# Altium schematic sheet Sheet1.SchDoc
size A2; SheetNumber: 1; SheetTotal: 1
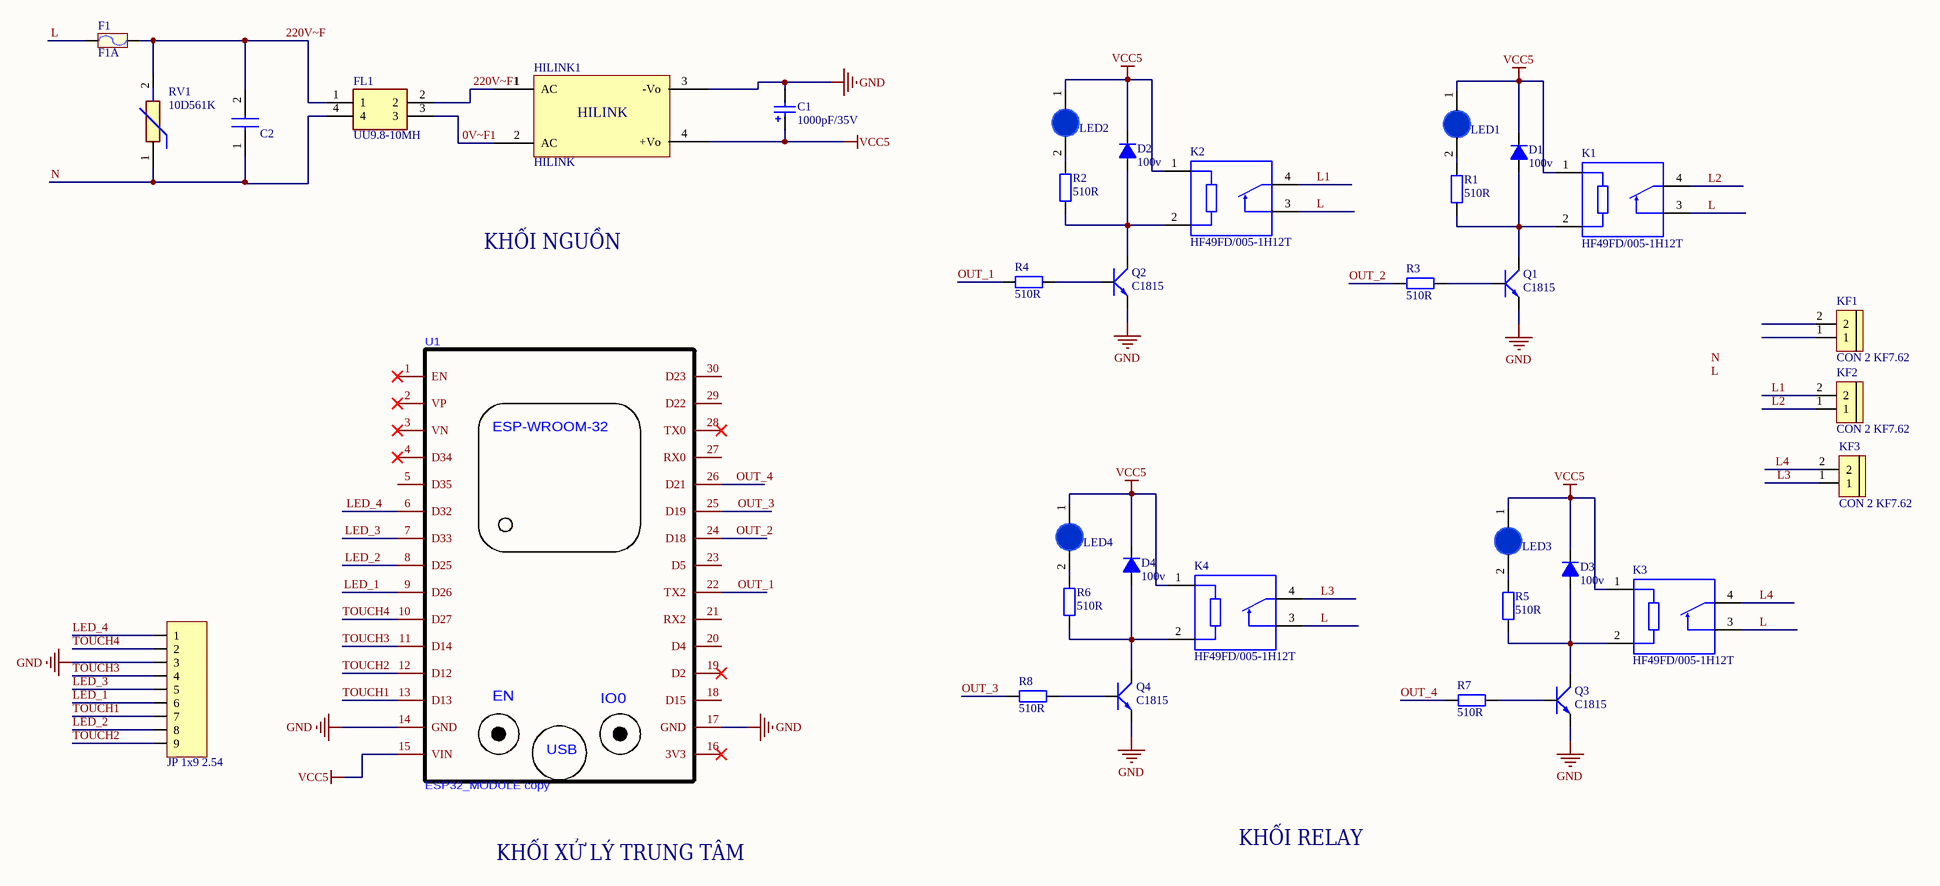
[diagram p0: Sheet1.SchDoc]

## Parts
C1  value 1000pF/35V  [CP2/5]  (hidden comment: Cap Pol3)
C2  R46KF3100JMP0K  [R46KF3100JMP0K]  (value not drawn)
D1  100v  [DIODE 0.5A]
D2  100v  [DIODE 0.5A]
D3  100v  [DIODE 0.5A]
D4  100v  [DIODE 0.5A]
F1  F1A  [Fuse]
FL1  UU9.8-10MH  [UU9810MH]
HILINK1  HILINK  [HILINK_1W]
JP1  JP 1x9 2.54  [JP 1x9 CT]
K1  HF49FD/005-1H12T  [RELAY_HF49FD/005-1H12T]
K2  HF49FD/005-1H12T  [RELAY_HF49FD/005-1H12T]
K3  HF49FD/005-1H12T  [RELAY_HF49FD/005-1H12T]
K4  HF49FD/005-1H12T  [RELAY_HF49FD/005-1H12T]
KF1  CON 2 KF7.62  [CON 2 KF7.62]
KF2  CON 2 KF7.62  [CON 2 KF7.62]
KF3  CON 2 KF7.62  [CON 2 KF7.62]
LED1  LED 3mm  [LED-3MM-BLUE]  (value not drawn)
LED2  LED 3mm  [LED-3MM-BLUE]  (value not drawn)
LED3  LED 3mm  [LED-3MM-BLUE]  (value not drawn)
LED4  LED 3mm  [LED-3MM-BLUE]  (value not drawn)
Q1  C1815  [C1815_cam]
Q2  C1815  [C1815_cam]
Q3  C1815  [C1815_cam]
Q4  C1815  [C1815_cam]
R1  510R  [R1/4W]
R2  510R  [R1/4W]
R3  510R  [R1/4W]
R4  510R  [R1/4W]
R5  510R  [R1/4W]
R6  510R  [R1/4W]
R7  510R  [R1/4W]
R8  510R  [R1/4W]
RV1  10D561K  [10D561K]
U1  ESP32_MODULE copy  [ESP32-WIFIMODULE-FOOTPRINT]

## Nets
GND: C1.2 HILINK1.3(-Vo) JP1.3 Q1.1(E) Q2.1(E) Q3.1(E) Q4.1(E) U1.14(GND) U1.17(GND)
VCC5: C1.1 D1.2(K) D2.2(K) D3.2(K) D4.2(K) HILINK1.4(+Vo) K1.1(L1) K2.1(L1) K3.1(L1) K4.1(L1) LED1.1(A) LED2.1(A) LED3.1(A) LED4.1(A) U1.15(VIN)
0V~F1: FL1.3 HILINK1.2(AC)
220V~F: C2.2 F1.2 FL1.1 RV1.2
220V~F1: FL1.2 HILINK1.1(AC)
L: F1.1 K1.3(C2) K2.3(C2) K3.3(C2) K4.3(C2)
L1: K2.4(C1) KF2.2
L2: K1.4(C1) KF2.1
L3: K4.4(C1) KF3.1
L4: K3.4(C1) KF3.2
LED_1: JP1.6 U1.9(D26)
LED_2: JP1.8 U1.8(D25)
LED_3: JP1.5 U1.7(D33)
LED_4: JP1.1 U1.6(D32)
N: C2.1 FL1.4 RV1.1
OUT_1: R4.1 U1.22(TX2)
OUT_2: R3.1 U1.24(D18)
OUT_3: R8.1 U1.25(D19)
OUT_4: R7.1 U1.26(D21)
TOUCH1: JP1.7 U1.13(D13)
TOUCH2: JP1.9 U1.12(D12)
TOUCH3: JP1.4 U1.11(D14)
TOUCH4: JP1.2 U1.10(D27)
NetD1_1: D1.1(A) K1.2(L2) Q1.2(C) R1.2
NetD2_1: D2.1(A) K2.2(L2) Q2.2(C) R2.2
NetD3_1: D3.1(A) K3.2(L2) Q3.2(C) R5.2
NetD4_1: D4.1(A) K4.2(L2) Q4.2(C) R6.2
NetLED1_2: LED1.2(K) R1.1
NetLED2_2: LED2.2(K) R2.1
NetLED3_2: LED3.2(K) R5.1
NetLED4_2: LED4.2(K) R6.1
NetQ1_3: Q1.3(B) R3.2
NetQ2_3: Q2.3(B) R4.2
NetQ3_3: Q3.3(B) R7.2
NetQ4_3: Q4.3(B) R8.2

Not connected (* = marked no-connect by the designer): KF1 1 2; U1 1(EN)* 2(VP)* 3(VN)* 4(D34)* 5(D35) 16(3V3)* 18(D15) 19(D2)* 20(D4) 21(RX2) 23(D5) 27(RX0) 28(TX0)* 29(D22) 30(D23)

## Notes on the sheet
- KHỐI NGUỒN
- KHỐI XỬ LÝ TRUNG TÂM
- KHỐI RELAY
- Labels drawn without touching a wire or pin: L, N
- (in symbol ESP32_MODULE copy) ESP-WROOM-32; IO0; USB

## Library data of the parts
C1 = Cap Pol3: Polarized Capacitor (Surface Mount); VALUE: C?; LatestRevisionDate: 17-Jul-2002; LatestRevisionNote: Re-released for DXP Platform.; PackageReference: C0805; Publisher: Altium Limited
C2 = R46KF3100JMP0K: Capacitor; Manufacturer_Name: Kemet; Datasheet Link: https://api.kemet.com/component-edge/download/specsheet/R46KF3100JMP0K.pdf; Height: 12.1mm; Manufacturer_Part_Number: R46KF3100JMP0K; Mouser Part Number: 80-R46KF3100JMP0K; Mouser Price/Stock: https://www.mouser.co.uk/ProductDetail/KEMET/R46KF3100JMP0K/?qs=gt1LBUVyoHk5JqGpZKIGRw%3D%3D
D1-D4 = Diode 1N4148: Cắm; Ten_Linh_Kien: Diode 1N4148 DO35 450mA 100V ( 1N4148 DIP); Don_Vi: Con; Ma_Hang: MH001065; Ghi Chu: *; Kieu_Chan: *; Chung_Loai: Cắm
F1 = Fuse: Designed by: VanDungEvn; Value: Fuse
FL1 = UU9.8-10MH: Filter; Manufacturer_Name: Guangdong Fenghua Advanced Tech; Datasheet Link: https://datasheet.lcsc.com/szlcsc/1811111206_Guangdong-Fenghua-Advanced-Tech-UU9-8-10mH_C148474.pdf; Height: 17mm; Manufacturer_Part_Number: UU9.8-10MH
JP1 = JP 1x9 2.54 Cai Thang: Cắm; Ten_Linh_Kien: Jump Đơn Cái 2.54MM 1x20P Thẳng; Don_Vi: Con; Ma_Hang: MH004006; Ghi_Chu: *; Kieu_Chan: *; Chung_Loai: Cắm
K1-K4 = HF49FD/005-1H12T: Relay: electromagnetic; SPST-NO; Ucoil: 5VDC; 5A/250VAC; 5A/30VDC; MF: Hongfa; Price: None; SnapEDA_Link: https://www.snapeda.com/parts/HF49FD/005-1H12T/Hongfa/view-part/2753221/?ref=snap; MP: HF49FD/005-1H12T; Value: *; Availability: Unavailable; Package: None
KF1-KF3 = CON 2 KF7.62: Cắm; Ma_Hang: MH002053; Ten_Linh_Kien: CON 2 KF7.62-2P 7.62MM (Đen Thẳng); Chung_Loai: Cắm; Ghi_Chu: *; Kieu_Chan: *; Don_Vi: Con
LED1-LED4 = LED 3mm Xanh Duong: Cắm; Don_Vi: Con; Ma_Hang: MH009003; Ten_Linh_Kien: LED 3MM Xanh Dương SS (1000c); Ghi_Chu: *; Kieu_Chan: *; Chung_Loai: Cắm
Q1-Q4 = C1815: NPN 600mW, ECB; Value: C1815
R1-R8 = R1/4W: Resistor 1/4W; Value: R1/4W - 1K
RV1 = 10D561K: Varistor; Manufacturer_Name: Bourns; Manufacturer_Part_Number: MOV-10D561K; Datasheet Link: https://www.bourns.com/docs/Product-Datasheets/MOV10D.pdf; Height: 15.5mm; Mouser Part Number: 652-MOV-10D561K; Mouser Price/Stock: https://www.mouser.co.uk/ProductDetail/Bourns/MOV-10D561K?qs=lgttKnAd%252B2ArrqGQgWwr6w%3D%3D; Arrow Part Number: MOV-10D561K; Arrow Price/Stock: https://www.arrow.com/en/products/mov-10d561k/bourns